# EasyEDA Pro project PCB_FT-LINK-v2_2024-04-09.epro

# Board PCB_FT-LINK-v2
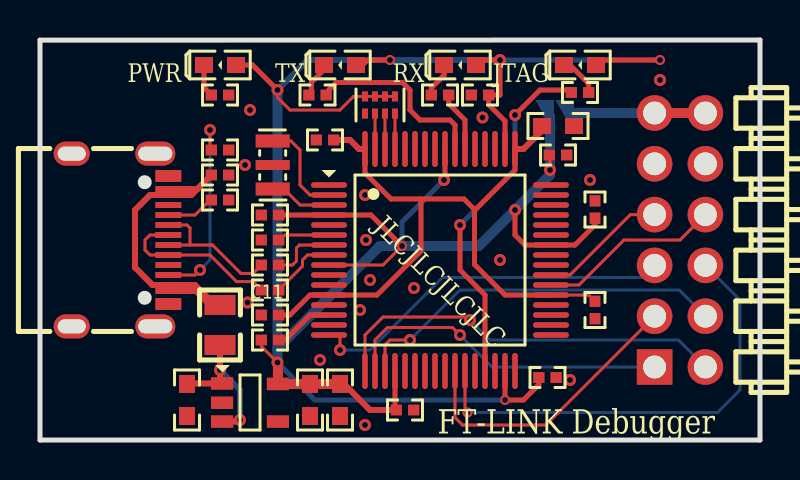
[diagram p0: board, top side]
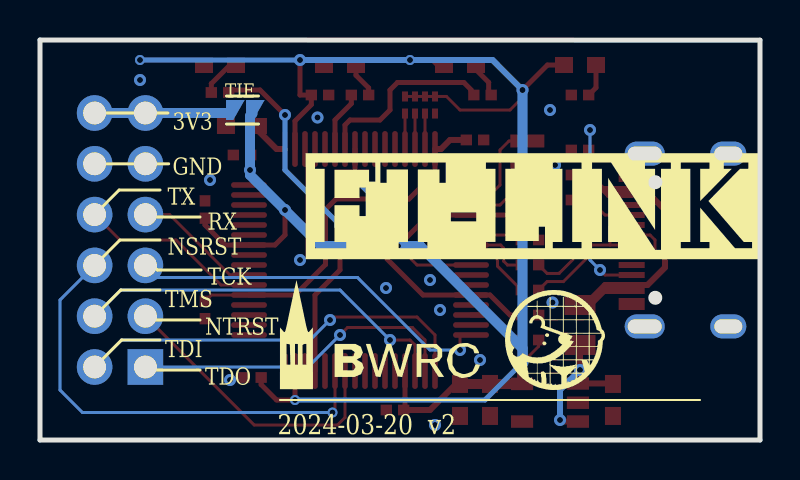
[diagram p1: board, bottom side, seen from below]

Outline 36 x 20 mm; copper layers: Top Layer, Bottom Layer. Coordinates in mm from the lower left corner of the outline.
Outline path: 0,19.99 0,0 36,0 36,20 0,19.99
Stack: Top Layer 0.035mm / Dielectric1 1.51mm FR4 er 4.5 / Bottom Layer 0.035mm

## Design rules (mm)
net USB_DP: USB_1
net USB_DM: USB_1
net $R8_1: USB_2
net $R6_1: USB_2
template: 用户自定义配置
spacing Default (default): track to track 0.15, other pairs 0 to 0.15
track width Default (default): min 0.15, default 0.15, max 25.4
differential pair differentialPair (default): width min 0.127, default 0.254, max 2.54; gap min 0.152, default 0.152
via Default (default): diameter min 0.5, default 0.5, max 100.025; hole min 0.3, default 0.3, max 59.995
pour e241 uses Default

## Placement (name value [footprint] x y rotation side)
C1  10u  [CAPA-0603]  7.35 2 90 top
C2  10u  [CAPA-0603]  13.5 2 90 top
C3  10u  [CAPA-0603]  15 2 90 top
C4  100n  [CAPA-0402]  25.9 14.25 180 top
C5  100n  [CAPA-0402]  11.5 11.25 0 top
C6  100n  [CAPA-0402]  18.25 1.5 180 top
C7  100n  [CAPA-0402]  25.38 3.13 180 top
C8  3u3  [CAPA-0603]  25.9 15.7 0 top
C9  100n  [CAPA-0402]  14.25 15 0 top
C10  100n  [CAPA-0402]  27.75 6.5 90 top
C11  100n  [CAPA-0402]  11.5 6.25 0 top
C12  100n  [CAPA-0402]  27.75 11.52 270 top
C13  10n  [CAPA-0402]  9 13.25 180 top
C14  100n  [CAPA-0402]  22 17.25 0 top
F1  6V 2A  [R0805]  9 5.75 270 top
H1  -  [CONN-TH_A2541WR-2X6P]  32 10 270 top
LED1  -  [LED-0603]  9 18.75 180 top
LED2  -  [LED-0603]  21 18.75 180 top
LED3  -  [LED-0603]  15 18.75 180 top
LED4  -  [LED-0603]  27 18.75 180 top
R1  470R  [RES-0402]  9 17.25 180 top
R2  470R  [RES-0402]  20 17.25 180 top
R3  470R  [RES-0402]  13.88 17.25 180 top
R4  470R  [RES-0402]  27 17.38 0 top
R5  5k1  [RES-0402]  9 14.5 0 top
R6  22R  [RES-0402]  11.5 7.5 0 top
R7  5k1  [RES-0402]  9 12 0 top
R8  22R  [RES-0402]  11.5 8.75 0 top
R9  12k  [RES-0402]  11.5 10 0 top
R10  1k  [RES-0402]  11.5 5 180 top
R11  0R  [RES-0402-TIE]  25.88 16.5 180 bottom
RN1  10k  [RES-ARRAY-SMD_0402-8P-L2.0-W1.0-BL]  17 16.75 180 top
U1  AP2112K-3.3TRG1  [SOT-25-5_L3.0-W1.8-P0.95-LS3.0-BR]  10.5 1.88 180 top
U2  FT2232HL-REEL  [LQFP-64_L10.0-W10.0-P0.50-LS12.0-TL]  20 9 0 top
USB1  USB-TYPEC  [USB-C-SMD_KH-TYPE-C-16P]  4 10 270 top
X1  12MHz  [OSC-SMD_3P-L3.2-W1.3-P1.2-L]  11.63 13.75 90 top

## Footprints (pads in the part's own frame, mm; a bottom-side part is the same pattern mirrored in y, then rotated)
CAPA-0402
  rect 0.566x0.54 smd: 1(-0.433,0) 2(0.433,0)
CAPA-0603
  rect 0.9x0.8 smd: 1(-0.798,-0.001) 2(0.801,-0.001)
CONN-TH_A2541WR-2X6P
  rect 1.778x1.778 hole 1.143: 1(6.35,-1.27)
  round 1.778 hole 1.143: 2(6.35,1.27) 3(3.81,-1.27) 4(3.81,1.27) 5(1.27,-1.27) 6(1.27,1.27) 7(-1.27,-1.27) 8(-1.27,1.27) 9(-3.81,-1.27) 10(-3.81,1.27) 11(-6.35,-1.27) 12(-6.35,1.27)
LED-0603
  rect 0.9x0.8 smd: 1(0.8,0) 2(-0.8,0)
LQFP-64_L10.0-W10.0-P0.50-LS12.0-TL
  oval 1.8x0.28 smd: 1(-5.55,3.75) 2(-5.55,3.25) 3(-5.55,2.75) 4(-5.55,2.25) 5(-5.55,1.75) 6(-5.55,1.25) 7(-5.55,0.75) 8(-5.55,0.25) 9(-5.55,-0.25) 10(-5.55,-0.75) 11(-5.55,-1.25) 12(-5.55,-1.75) 13(-5.55,-2.25) 14(-5.55,-2.75) 15(-5.55,-3.25) 16(-5.55,-3.75) 33(5.55,-3.75) 34(5.55,-3.25) 35(5.55,-2.75) 36(5.55,-2.25) 37(5.55,-1.75) 38(5.55,-1.25) 39(5.55,-0.75) 40(5.55,-0.25) 41(5.55,0.25) 42(5.55,0.75) 43(5.55,1.25) 44(5.55,1.75) 45(5.55,2.25) 46(5.55,2.75) 47(5.55,3.25) 48(5.55,3.75)
  oval 0.28x1.8 smd: 17(-3.75,-5.55) 18(-3.25,-5.55) 19(-2.75,-5.55) 20(-2.25,-5.55) 21(-1.75,-5.55) 22(-1.25,-5.55) 23(-0.75,-5.55) 24(-0.25,-5.55) 25(0.25,-5.55) 26(0.75,-5.55) 27(1.25,-5.55) 28(1.75,-5.55) 29(2.25,-5.55) 30(2.75,-5.55) 31(3.25,-5.55) 32(3.75,-5.55) 49(3.75,5.55) 50(3.25,5.55) 51(2.75,5.55) 52(2.25,5.55) 53(1.75,5.55) 54(1.25,5.55) 55(0.75,5.55) 56(0.25,5.55) 57(-0.25,5.55) 58(-0.75,5.55) 59(-1.25,5.55) 60(-1.75,5.55) 61(-2.25,5.55) 62(-2.75,5.55) 63(-3.25,5.55) 64(-3.75,5.55)
OSC-SMD_3P-L3.2-W1.3-P1.2-L
  rect 0.65x1.7 smd: 1(-1.2,0) 3(1.2,0)
  rect 0.5x1.7 smd: 2(0,0)
R0805
  rect 1x1.55 smd: 1(-1,0) 2(1,0)
RES-0402
  rect 0.566x0.54 smd: 1(-0.433,0) 2(0.433,0)
RES-0402-TIE
  custom 0.931x1 smd: 1(-0.5,0) 2(0.5,0)
  custom 0x0 smd: 4(0.525,0.017) 6(0.676,0.141)
RES-ARRAY-SMD_0402-8P-L2.0-W1.0-BL
  rect 0.3x0.505 smd: 1(-0.75,0.427) 2(-0.25,0.427) 3(0.25,0.427) 4(0.75,0.427) 5(0.75,-0.427) 6(0.25,-0.427) 7(-0.25,-0.427) 8(-0.75,-0.427)
SOT-25-5_L3.0-W1.8-P0.95-LS3.0-BR
  rect 1.105x0.623 smd: 1(1.397,-0.953) 2(1.397,0.013) 3(1.397,0.953) 4(-1.397,0.953) 5(-1.397,-0.927)
USB-C-SMD_KH-TYPE-C-16P
  oval 1.2x2 hole 0.7x1.7: 1(-4.32,1.765) 2(4.32,1.765)
  oval 1.2x1.8 hole 0.7x1.4: 3(-4.32,-2.415) 4(4.32,-2.415)
  rect 0.3x1.3 smd: A1(-3.35,2.415) A4(-2.55,2.415) A5(-1.25,2.415) A6(-0.25,2.415) A7(0.25,2.415) A8(1.25,2.415) A9(2.55,2.415) A12(3.35,2.415) B1(3.05,2.415) B4(2.25,2.415) B5(1.75,2.415) B6(0.75,2.415) B7(-0.75,2.415) B8(-1.75,2.415) B9(-2.25,2.415) B12(-3.05,2.415)

## Nets
3V3: C2.2 C3.2 C4.2 C5.2 C6.2 C7.2 C12.2 C14.2 LED1.2 LED2.2 LED3.2 LED4.2 R10.2 R11.2 RN1.5 RN1.6 RN1.7 RN1.8 U1.5 U2.4 U2.9 U2.20 U2.31 U2.42 U2.50 U2.56
5V: C1.2 F1.2 U1.1 U1.3
GND: C1.1 C2.1 C3.1 C4.1 C5.1 C6.1 C7.1 C8.2 C9.1 C10.1 C11.1 C12.1 C13.1 C14.1 H1.9 H1.10 R1.1 R5.2 R7.2 R9.1 U1.2 U2.1 U2.5 U2.10 U2.11 U2.13 U2.15 U2.25 U2.35 U2.47 U2.51 USB1.1 USB1.2 USB1.3 USB1.4 USB1.A1 USB1.A12 USB1.B1 USB1.B12 X1.2
$C13_2: C13.2 F1.1 USB1.A4 USB1.A9 USB1.B4 USB1.B9
$H1_11: H1.11 H1.12 R11.1
$LED1_1: LED1.1 R1.2
$LED2_1: LED2.1 R2.2
$LED3_1: LED3.1 R3.2
$LED4_1: LED4.1 R4.2
$R5_1: R5.1 USB1.B5
$R6_1: R6.1 USB1.A6 USB1.B6
$R7_1: R7.1 USB1.A5
$R8_1: R8.1 USB1.A7 USB1.B7
$R9_2: R9.2 U2.6
$R10_1: R10.1 U2.14
$RN1_1: RN1.1 U2.61
$RN1_2: RN1.2 U2.62
$RN1_3: RN1.3 U2.63
$U2_2: U2.2 X1.3
$U2_3: U2.3 X1.1
JTAGLED: R4.1 U2.29
NSRST: H1.6 U2.27
NTRST: H1.3 U2.26
RXD: H1.7 U2.39
RXLED: R2.1 U2.54
TCK: H1.5 U2.16
TDI: H1.2 U2.17
TDO: H1.1 U2.18
TMS: H1.4 U2.19
TXD: H1.8 U2.38
TXLED: R3.1 U2.55
USB_DM: R8.2 U2.7
USB_DP: R6.2 U2.8
VCORE: C8.1 C9.2 C10.2 C11.2 U2.12 U2.37 U2.49 U2.64

Pads without a net: R11 4 6; RN1 4; U1 4; U2 21 22 23 24 28 30 32 33 34 36 40 41 43 44 45 46 48 52 53 57 58 59 60; USB1 A8 B8

## Via types
v1: diameter 0.6, hole 0.3, Top Layer to Bottom Layer, 31 vias
v2: diameter 0.5, hole 0.3, Top Layer to Bottom Layer, 5 vias

## Routing (per net, layer and track width the routed paths; a pad name or vN(x,y) marks a point on that pad's centre or on a via; arc(x,y) is an arc through that point)
3V3: length 125.9
  Top Layer w0.15: v2(18.1,9.7) 17.15,8.75 U2.9 ; v1(11.88,3.88) 11.07,4.68 R10.2 ; v1(25.5,13.5) 25.5,14.22 C4.2 ; v1(11.88,17.5) 11.88,17.12 12.5,16.5 15,16.5 15.68,17.18 RN1.5 RN1.6 RN1.7 RN1.8
  Top Layer w0.25: U2.50 23.25,15.95 22.43,16.77 C14.2 23,17.25 v1(23,19) 22.05,19 LED2.2 ; LED4.2 28.05,19 v2(31,19) ; v1(23.75,11.5) 23.75,10.25 24.25,9.75 U2.42 26.75,9.75 27.75,10.75 C12.2 ; U2.56 20.25,13.05 v1(20.2,13) ; v2(18.1,9.7) 16.55,11.25 U2.4 C5.2 ; U2.31 v2(23.25,2) 24.17,2 24.94,2.77 C7.2 ; v2(17.5,19) 16.38,19 16.13,18.75 ; 10,18.75 10.62,18.75 v1(11.88,17.5) ; U2.20 17.75,1.5
  Top Layer w0.3: 17.75,1.5 16.5,1.5 15.2,2.8 C3.2 ; 17.75,1.5 C6.2
  Top Layer w0.5: v1(11.88,3.88) 11.9,3.85 11.9,2.8 15,2.8
  Bottom Layer w0.15: 11.9,3.5 11.88,3.53 v1(11.88,3.88)
  Bottom Layer w0.25: v2(18.1,9.7) 18.1,10.9 v1(20.2,13) ; v1(11.88,3.88) 13.75,2 v2(23.25,2) ; v1(23,19) v2(31,19)
  Bottom Layer w0.3: v1(23,19) v2(17.5,19) 13.37,19 v1(11.88,17.5)
  Bottom Layer w0.5: 11.87,17.5 11.87,3.88 ; 25.38,16.31 25.5,16.19 25.5,13.25 v1(23.75,11.5) ; 23.75,11.5 21.95,9.7 v2(18.1,9.7) 16.99,9.7 11.88,4.58 v1(11.88,3.88)
5V: length 7
  Top Layer w0.3: v1(10,1) 10,0.94 9.98,0.92 U1.3 ; 9,4.5 v1(9,3.5) 9,3.1 ; C1.2 7.38,2.83 U1.1
  Bottom Layer w0.3: v1(9,3.5) 10,2.5 v1(10,1)
GND:
  vias: v1(10.25,13.75) v1(10.38,6.88) v1(10.5,16.5) v1(14,4) v1(16,6.5) v1(16.25,12.25) v1(16.25,0.75) v1(16.3,10) v1(16.5,8) v1(18.7,7.6) v1(22.12,16.12) v1(23,9) v1(26.5,3) v1(27.5,13) v1(31,18)
$C13_2: length 17.6
  Top Layer w0.3: 7.87,12.55 USB1.A4 USB1.B9 7.57,12.25 7.87,12.55 ; 7.87,12.55 C13.2 ; 6.41,12.25 5.5,12.25 4.75,11.5 4.75,8.63 5.62,7.75 6.41,7.75 ; USB1.B4 7.75,7.75 9,6.5 8.75,6.5 7.8,7.45 USB1.A9 USB1.B4
$H1_11: length 7
  Bottom Layer w0.5: R11.1 26.53,16.35 H1.11 H1.12
$H2_11: length 2.5
  Top Layer w0.5: 30.73,16.35 33.27,16.35
$LED1_1: length 1.7
  Top Layer w0.25: LED1.1 8.2,17.62 R1.2
$LED2_1: length 1.8
  Top Layer w0.25: LED2.1 20.2,18.24 19.57,17.6 R2.2
$LED3_1: length 1.7
  Top Layer w0.25: 14.4,18.89 14.4,18.72 13.57,17.88 13.57,17.5
$LED4_1: length 1.9
  Top Layer w0.25: LED4.1 26.5,18.75 27.43,17.82 27.43,17.5
$R5_1: length 9.9
  Top Layer w0.15: v1(8.5,15.5) 8.5,14.57 R5.1 ; USB1.B5 7.75,8.25 v1(8,8.5)
  Bottom Layer w0.15: v1(8,8.5) 8.5,9 v1(8.5,15.5)
$R6_1: length 8.4
  Top Layer w0.15: R6.1 10.65,7.92 9.83,7.92 8.5,9.25 USB1.B6 5.5,9.25 5.25,9.5 5.25,10 5.5,10.25 USB1.A6
$R7_1: length 2.5
  Top Layer w0.15: USB1.A5 7.75,11.25 8.5,12 R7.1
$R8_1: length 7.4
  Top Layer w0.15: 7.5,9.75 7.5,10.6 7.35,10.75 USB1.B7 ; 7.5,9.75 8.62,9.75 10.05,8.33 10.65,8.33 R8.1 ; 7.5,9.75 USB1.A7
$R9_2: length 2.6
  Top Layer w0.15: 12,10 12.25,10.25 U2.6
$R10_1: length 3
  Top Layer w0.25: U2.14 13.5,6.25 12.25,5 R10.1
$RN1_1: length 1.8
  Top Layer w0.15: U2.61 17.75,16.39
$RN1_2: length 1.8
  Top Layer w0.15: U2.62 17.25,16.39
$RN1_3: length 1.8
  Top Layer w0.15: U2.63 16.75,16.39
$U2_2: length 5
  Top Layer w0.15: X1.3 12.55,14.95 13,14.5 13,12.75 13.5,12.25 U2.2
$U2_3: length 3.1
  Top Layer w0.15: U2.3 13,11.75 12.2,12.55 X1.1
JTAGLED: length 17.8
  Top Layer w0.25: U2.29 22.25,7.25 21,8.5 v1(21,10.75) ; 26.57,17.5 25,17.5 v1(23.75,16.25)
  Bottom Layer w0.25: v1(23.75,16.25) 23.75,13.5 v1(21,10.75)
NSRST: length 23.2
  Top Layer w0.15: v2(21.38,1.38) 21.25,1.5 U2.27
  Bottom Layer w0.15: v2(21.38,1.38) 33.88,1.38 35,2.5 35,7 H1.6
NTRST: length 14.7
  Top Layer w0.15: U2.26 20.75,1.12 21.12,0.75 25.29,0.75 H1.3
RXD: length 6.4
  Top Layer w0.15: H1.7 29.52,11.27 26.5,8.25 U2.39
RXLED: length 3
  Top Layer w0.25: R2.1 20.43,16.82 21.25,16 U2.54
TCK: length 18.8
  Top Layer w0.15: U2.16 15,5.25 v1(15,4.5)
  Bottom Layer w0.15: H1.5 30.12,8.12 20.12,8.12 16.5,4.5 v1(15,4.5)
TDI: length 20.2
  Top Layer w0.15: U2.17 16.25,5.25 17.15,6.15 21.35,6.15 v1(21.5,6)
  Bottom Layer w0.15: v1(21.5,6) 22.5,5 31.92,5 H1.2
TDO: length 16.6
  Top Layer w0.15: U2.18 16.75,5 17.38,5.62 20.62,5.62 v1(21,5.25)
  Bottom Layer w0.15: H1.1 22.6,3.65 v1(21,5.25)
TMS: length 19
  Top Layer w0.15: U2.19 17.25,4.75 17.5,5 v1(18.5,5)
  Bottom Layer w0.15: v1(18.5,5) 21,7.5 31.96,7.5 H1.4
TXD: length 9.2
  Top Layer w0.15: H1.8 32,10 29.2,10 26.95,7.75 U2.38
TXLED: length 9.1
  Top Layer w0.25: U2.55 20.75,15.75 20.5,16 19,16 18.5,16.5 18.5,17.5 18.12,17.88 14.81,17.88 14.43,17.5
USB_DM: length 3.3
  Top Layer w0.15: U2.7 12.97,9.75 12.82,9.6 12.82,8.95 12.62,8.75 R8.2
USB_DP: length 3.4
  Top Layer w0.15: U2.8 13.38,9.25 13.12,9 13.12,8.69 R6.2
VCORE: length 35.6
  Top Layer w0.15: C10.2 27.43,7.25 U2.37
  Top Layer w0.25: 21.75,11.5 23.75,13.5 U2.49 ; 21.75,11.5 21.72,11.47 21.72,8.78 23.25,7.25 U2.37 ; 21.75,11.5 21.2,12.05 19.05,12.05 ; U2.64 16.25,13.35 17.55,12.05 19.05,12.05 ; 19.05,12.05 19.05,9.45 16.85,7.25 U2.12 13.5,7.25 12.5,6.25 C11.2
  Top Layer w0.3: U2.49 24.18,14.55 25.1,15.48 C8.1 ; U2.64 15.95,14.55 15.5,15 C9.2

## Copper pours and planes (outline as drawn; the poured copper is in the pictures)
GND on Top Layer: -10.15,26.42 -10.15,-5.58 43.85,-5.58 43.85,26.42
GND on Bottom Layer: -11.1,25.4 -11.1,-6.6 42.9,-6.6 42.9,25.4

## Text on the board
Bottom Silkscreen Layer: TIE | TCK | NTRST | TDO | NSRST | TMS | TDI | RX | 3V3 | GND | TX | 2024-03-20  v2 | FT-LINK
Top Silkscreen Layer: PWR | TX | RX | JTAG | JLCJLCJLCJLC | FT-LINK Debugger
